# Altium schematic sheet control.SchDoc
size A3
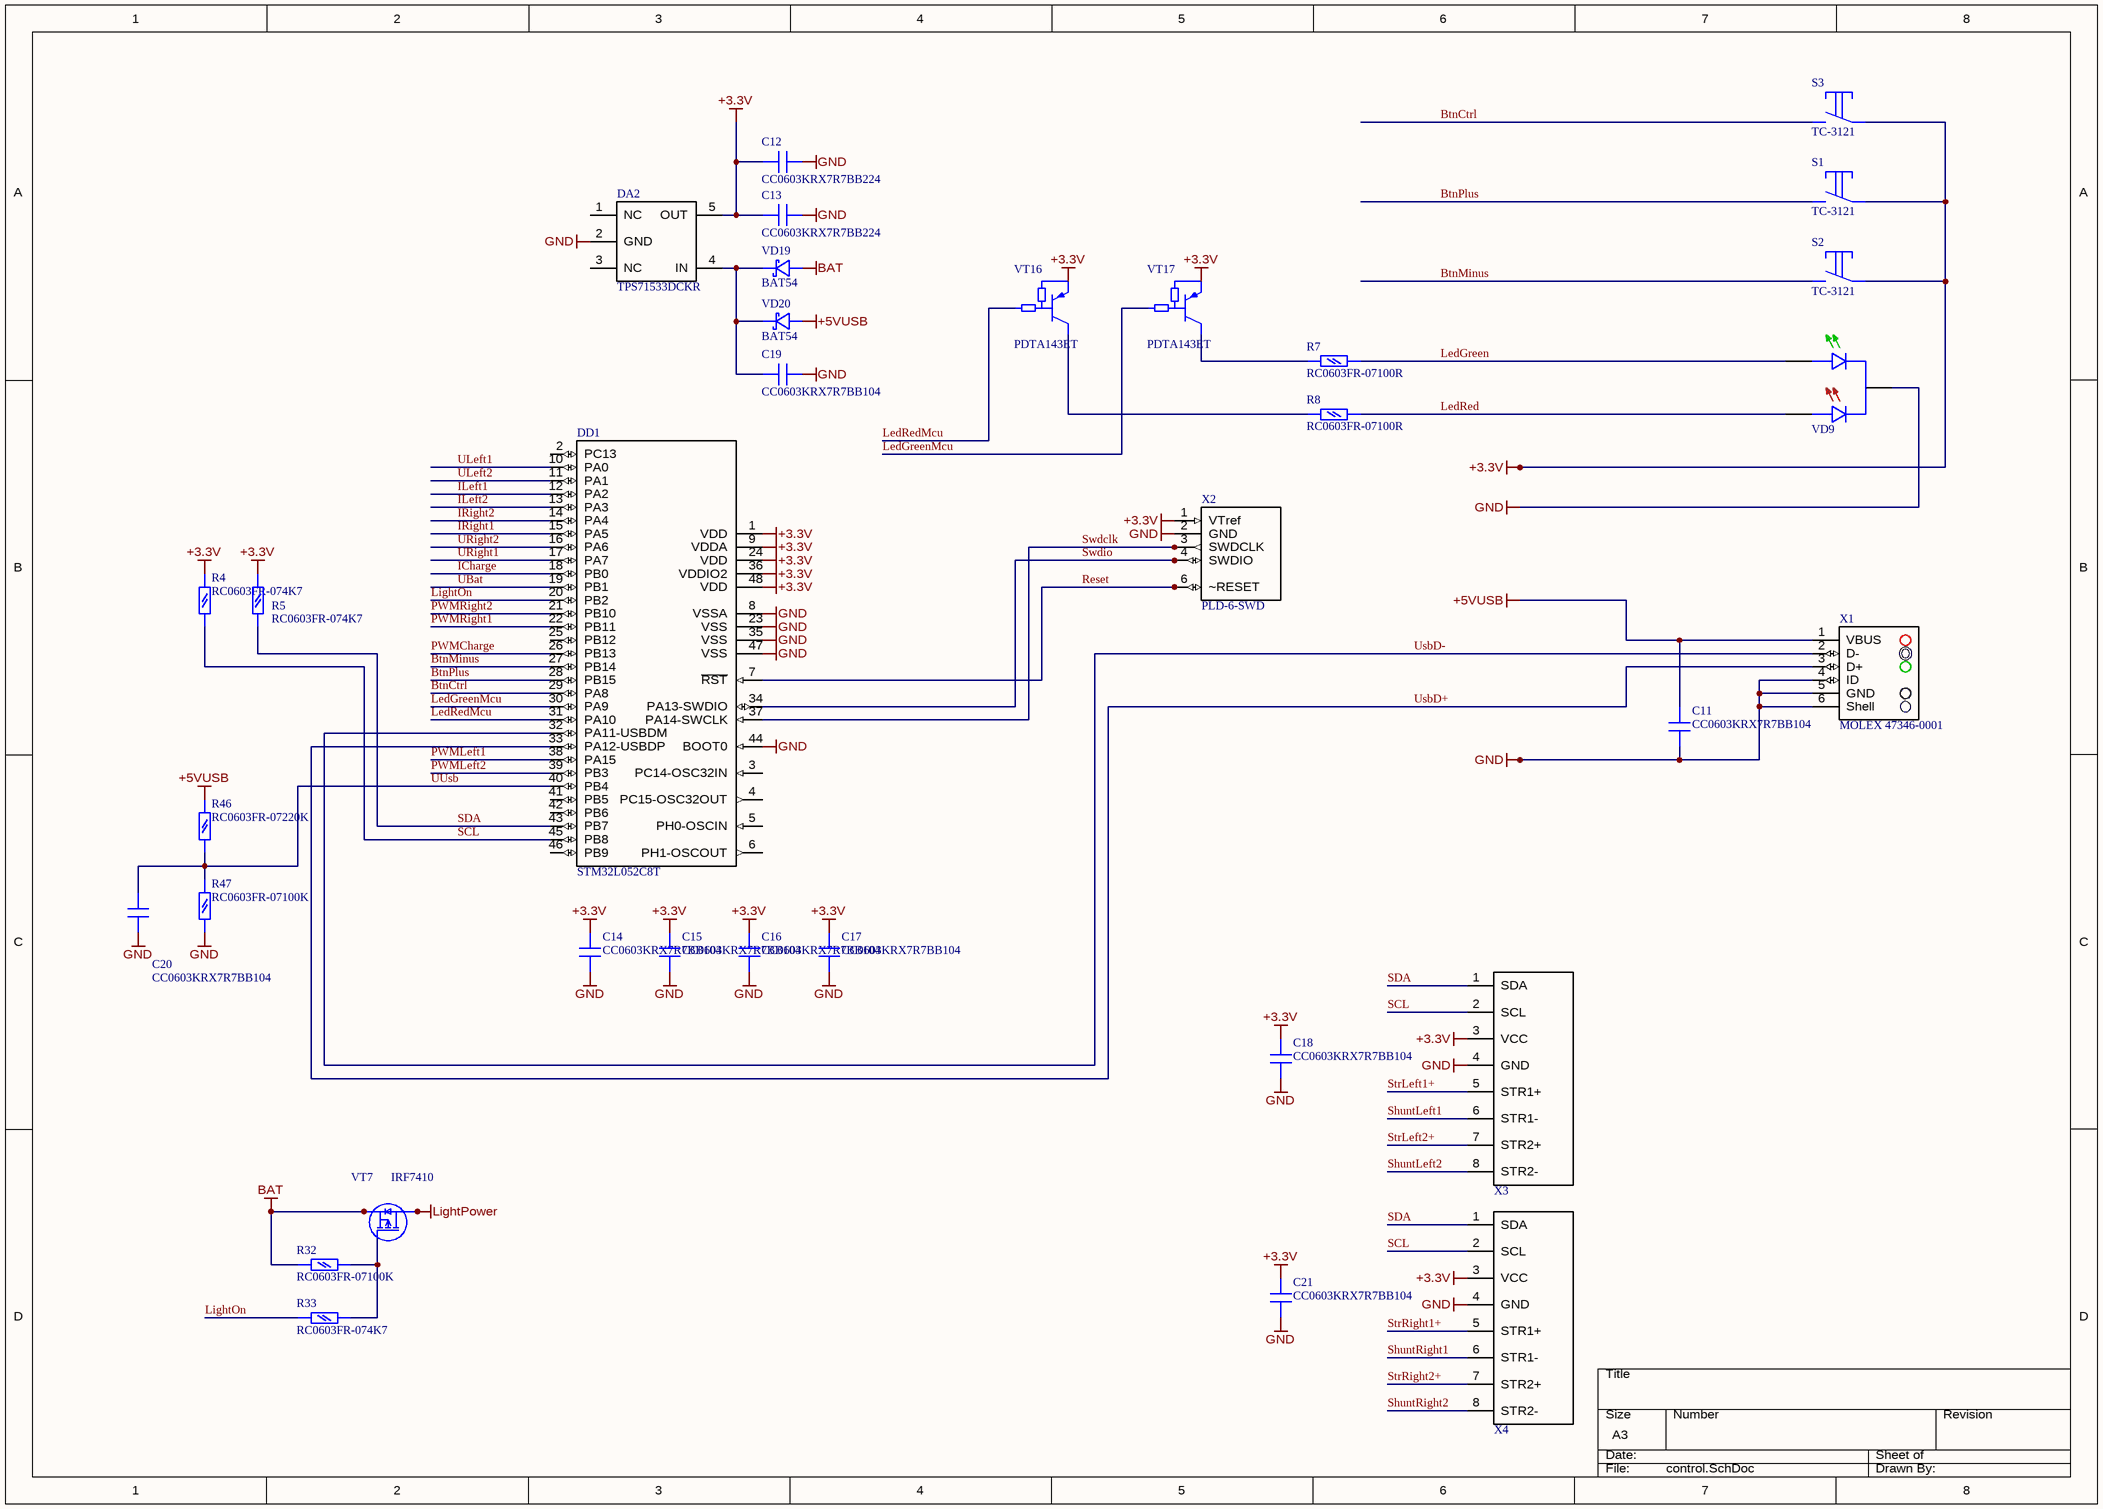
[diagram p0: control.SchDoc]

## Parts
C11  CC0603KRX7R7BB104  [CapacitorSMD0603(manual)]
C12  CC0603KRX7R7BB224  [CapacitorSMD0603(manual)]
C13  CC0603KRX7R7BB224  [CapacitorSMD0603(manual)]
C14  CC0603KRX7R7BB104  [CapacitorSMD0603(manual)]
C15  CC0603KRX7R7BB104  [CapacitorSMD0603(manual)]
C16  CC0603KRX7R7BB104  [CapacitorSMD0603(manual)]
C17  CC0603KRX7R7BB104  [CapacitorSMD0603(manual)]
C18  CC0603KRX7R7BB104  [CapacitorSMD0603(manual)]
C19  CC0603KRX7R7BB104  [CapacitorSMD0603(manual)]
C20  CC0603KRX7R7BB104  [CapacitorSMD0603(manual)]
C21  CC0603KRX7R7BB104  [CapacitorSMD0603(manual)]
DA2  TPS71533DCKR  [SOT323-5]
DD1  STM32L052C8T  [LQFP48_STM32]
R4  RC0603FR-074K7  [ResistorSMD0603(manual)]
R5  RC0603FR-074K7  [ResistorSMD0603(manual)]
R7  RC0603FR-07100R  [ResistorSMD0603(manual)]
R8  RC0603FR-07100R  [ResistorSMD0603(manual)]
R32  RC0603FR-07100K  [ResistorSMD0603(manual)]
R33  RC0603FR-074K7  [ResistorSMD0603(manual)]
R46  RC0603FR-07220K  [ResistorSMD0603(manual)]
R47  RC0603FR-07100K  [ResistorSMD0603(manual)]
S1  TC-3121  [TC-3121(right-angle var1)]
S2  TC-3121  [TC-3121(right-angle var1)]
S3  TC-3121  [TC-3121(right-angle var1)]
VD9  L-119EGWT  [L-119EGWT(rightAngleVar1)]  (value not drawn)
VD19  BAT54  [SOT23]
VD20  BAT54  [SOT23]
VT7  IRF7410  [SO8]
VT16  PDTA143ET  [SOT23]
VT17  PDTA143ET  [SOT23]
X1  MOLEX 47346-0001  [MOLEX 47346-0001]
X2  PLD-6-SWD  [PLD-6-SWD]  (no BOM)
X3  ConnectorMainSide  [ConnectorMainSide]  (value not drawn)  (no BOM)
X4  ConnectorMainSide  [ConnectorMainSide]  (value not drawn)  (no BOM)

## Nets
+3.3V: C12.2 C13.2 C14.2 C15.2 C16.2 C17.2 C18.2 C21.2 DA2.5(OUT) DD1.1(VDD) DD1.9(VDDA) DD1.24(VDD) DD1.36(VDDIO2) DD1.48(VDD) R4.1 R5.1 S1.2 S2.2 S3.2 VT16.2 VT17.2 X2.1(VTref) X3.3(VCC) X4.3(VCC)
+5VUSB: C11.2 R46.1 VD20.1 X1.1(VBUS)
BAT: R32.2 VD19.1 VT7.1(S) VT7.2(S) VT7.3(S)
GND: C11.1 C12.1 C13.1 C14.1 C15.1 C16.1 C17.1 C18.1 C19.1 C20.2 C21.1 DA2.2(GND) DD1.8(VSSA) DD1.23(VSS) DD1.35(VSS) DD1.44(BOOT0) DD1.47(VSS) R47.2 VD9.2 X1.4(ID) X1.5(GND) X1.6(Shell) X2.2(GND) X3.4(GND) X4.4(GND)
LightPower: VT7.5(D) VT7.6(D) VT7.7(D) VT7.8(D)
BtnCtrl: DD1.29(PA8) S3.1
BtnMinus: DD1.27(PB14) S2.1
BtnPlus: DD1.28(PB15) S1.1
ICharge: DD1.18(PB0)
ILeft1: DD1.12(PA2)
ILeft2: DD1.13(PA3)
IRight1: DD1.15(PA5)
IRight2: DD1.14(PA4)
LedGreen: R7.2 VD9.3
LedGreenMcu: DD1.30(PA9) VT17.1
LedRed: R8.2 VD9.1
LedRedMcu: DD1.31(PA10) VT16.1
LightOn: DD1.20(PB2) R33.2
PWMCharge: DD1.26(PB13)
PWMLeft1: DD1.38(PA15)
PWMLeft2: DD1.39(PB3)
PWMRight1: DD1.22(PB11)
PWMRight2: DD1.21(PB10)
Reset: DD1.7(~{RST}) X2.6(~RESET)
SCL: DD1.45(PB8) R4.2 X3.2(SCL) X4.2(SCL)
SDA: DD1.43(PB7) R5.2 X3.1(SDA) X4.1(SDA)
ShuntLeft1: X3.6(STR1-)
ShuntLeft2: X3.8(STR2-)
ShuntRight1: X4.6(STR1-)
ShuntRight2: X4.8(STR2-)
StrLeft1+: X3.5(STR1+)
StrLeft2+: X3.7(STR2+)
StrRight1+: X4.5(STR1+)
StrRight2+: X4.7(STR2+)
Swdclk: DD1.37(PA14-SWCLK) X2.3(SWDCLK)
Swdio: DD1.34(PA13-SWDIO) X2.4(SWDIO)
UBat: DD1.19(PB1)
ULeft1: DD1.10(PA0)
ULeft2: DD1.11(PA1)
URight1: DD1.17(PA7)
URight2: DD1.16(PA6)
UsbD+: DD1.33(PA12-USBDP) X1.3(D+)
UsbD-: DD1.32(PA11-USBDM) X1.2(D-)
UUsb: C20.1 DD1.40(PB4) R46.2 R47.1
NetC19_2: C19.2 DA2.4(IN) VD19.3 VD20.3
NetR7_1: R7.1 VT17.3
NetR8_1: R8.1 VT16.3
NetR32_1: R32.1 R33.1 VT7.4(G)

Not connected (* = marked no-connect by the designer): DA2 1(NC) 3(NC); DD1 2(PC13) 3(PC14-OSC32IN) 4(PC15-OSC32OUT) 5(PH0-OSCIN) 6(PH1-OSCOUT) 25(PB12) 41(PB5) 42(PB6) 46(PB9)

## Library data of the parts
C11-C21 = CapacitorSMD0603(reflow): CAPACITOR Capacitor SMD 0603 1.6x0.8mm; Описание: Конденсатор SMD 0603; NumberSolderPointsSMD: 0; Аналог: нет; NumberSolderPointsTHT: 0
DA2 = TPS715__DCKR: IC LDO; Описание: Микросхема SOT323-5; NumberSolderPointsSMD: 5; NumberSolderPointsTHT: 0; Аналог: нет; x: TPS71525DCKR,TPS71533DCKR,...
DD1 = STM32L052C_T: IC UC/UP; Аналог: нет; x: STM32L052C6T(32kByte flash),STM32L052C8T(64kByte flash); Описание: Микросхема LQFP48
R4 R5 R7 R8 R32 R33 R46 R47 = ResistorSMD0603(reflow): RESISTOR Resistor SMD 0603 1.6x0.8mm; Описание: Резистор SMD 0603; NumberSolderPointsSMD: 0; Аналог: нет; NumberSolderPointsTHT: 0
S1-S3 = TC-3121: SWITCH Button; Описание: Кнопка; NumberSolderPointsSMD: 0; Аналог: нет; NumberSolderPointsTHT: 0
VD9 = L-119EGWT: Right-angle red/green LED; Описание: Светодиод красный/зеленый; Аналог: *; NumberSolderPointsSMD: *; NumberSolderPointsTHT: *; Комплект: *
VD19 VD20 = BAT54: DIODE Schottky barrier diodes; Описание: Диод SOT23; NumberSolderPointsSMD: 0; Аналог: нет; NumberSolderPointsTHT: 0; x: *
VT7 = MOSFET_P_SO8: TRANSISTOR MOSFET P generic SO8; Описание: Транзистор SO8; NumberSolderPointsSMD: 0; NumberSolderPointsTHT: 8; Аналог: нет; x: IRF7410(12v,0.01ohm)
VT16 VT17 = PDTA143ET: TRANSISTOR PNP resistors-equipped transistor sot23; Описание: Транзистор SOT23; NumberSolderPointsSMD: 0; Аналог: нет; NumberSolderPointsTHT: 0
X1 = MOLEX 47346-0001: CONNECTOR USB micro B; Описание: Разъем USB micro; NumberSolderPointsSMD: 0; Аналог: нет; NumberSolderPointsTHT: 0; x: *
X2 = PLD-6-SWD: CONNECTOR PROGRAM 6-pin SWD connector; Описание: Разъем программатора; NumberSolderPointsSMD: 0; Аналог: нет; NumberSolderPointsTHT: 0